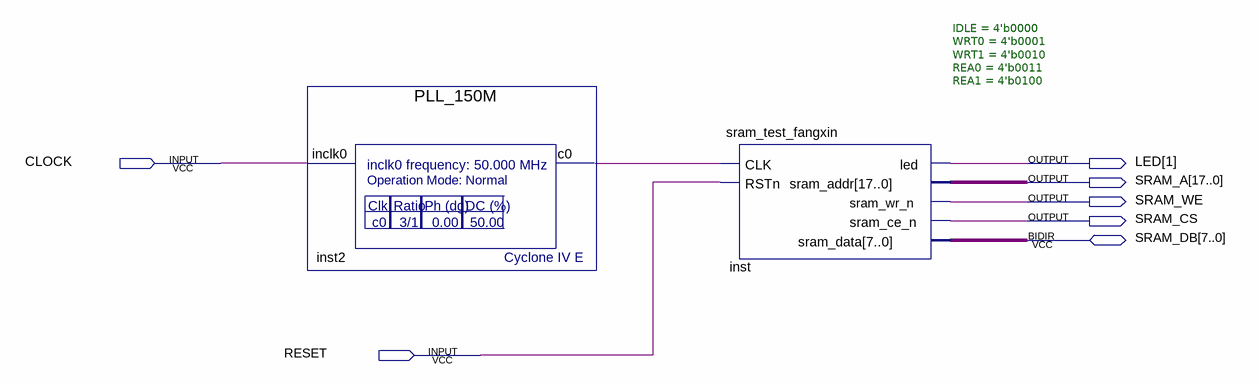
[diagram p0: schematic sheet]
// Quartus schematic SRAM_fangxin_LED_test.bdf as structural Verilog: 2 symbols, 7 pins
module SRAM_fangxin_LED_test (
  input  CLOCK,
  input  RESET,
  inout  [7:0] SRAM_DB,
  output [1:1] LED,
  output [17:0] SRAM_A,
  output SRAM_WE,
  output SRAM_CS
);

  wire inst2_c0;

  PLL_150M inst2 (.inclk0(CLOCK), .c0(inst2_c0));
  sram_test_fangxin #(.IDLE(4'b0000), .WRT0(4'b0001), .WRT1(4'b0010), .REA0(4'b0011), .REA1(4'b0100)) inst (
    .CLK(inst2_c0), .RSTn(RESET), .led(LED[1]), .sram_addr(SRAM_A), .sram_wr_n(SRAM_WE), .sram_ce_n(SRAM_CS),
    .sram_data(SRAM_DB));
endmodule
